# Altium schematic sheet ALARM_POWER.SchDoc
size A4
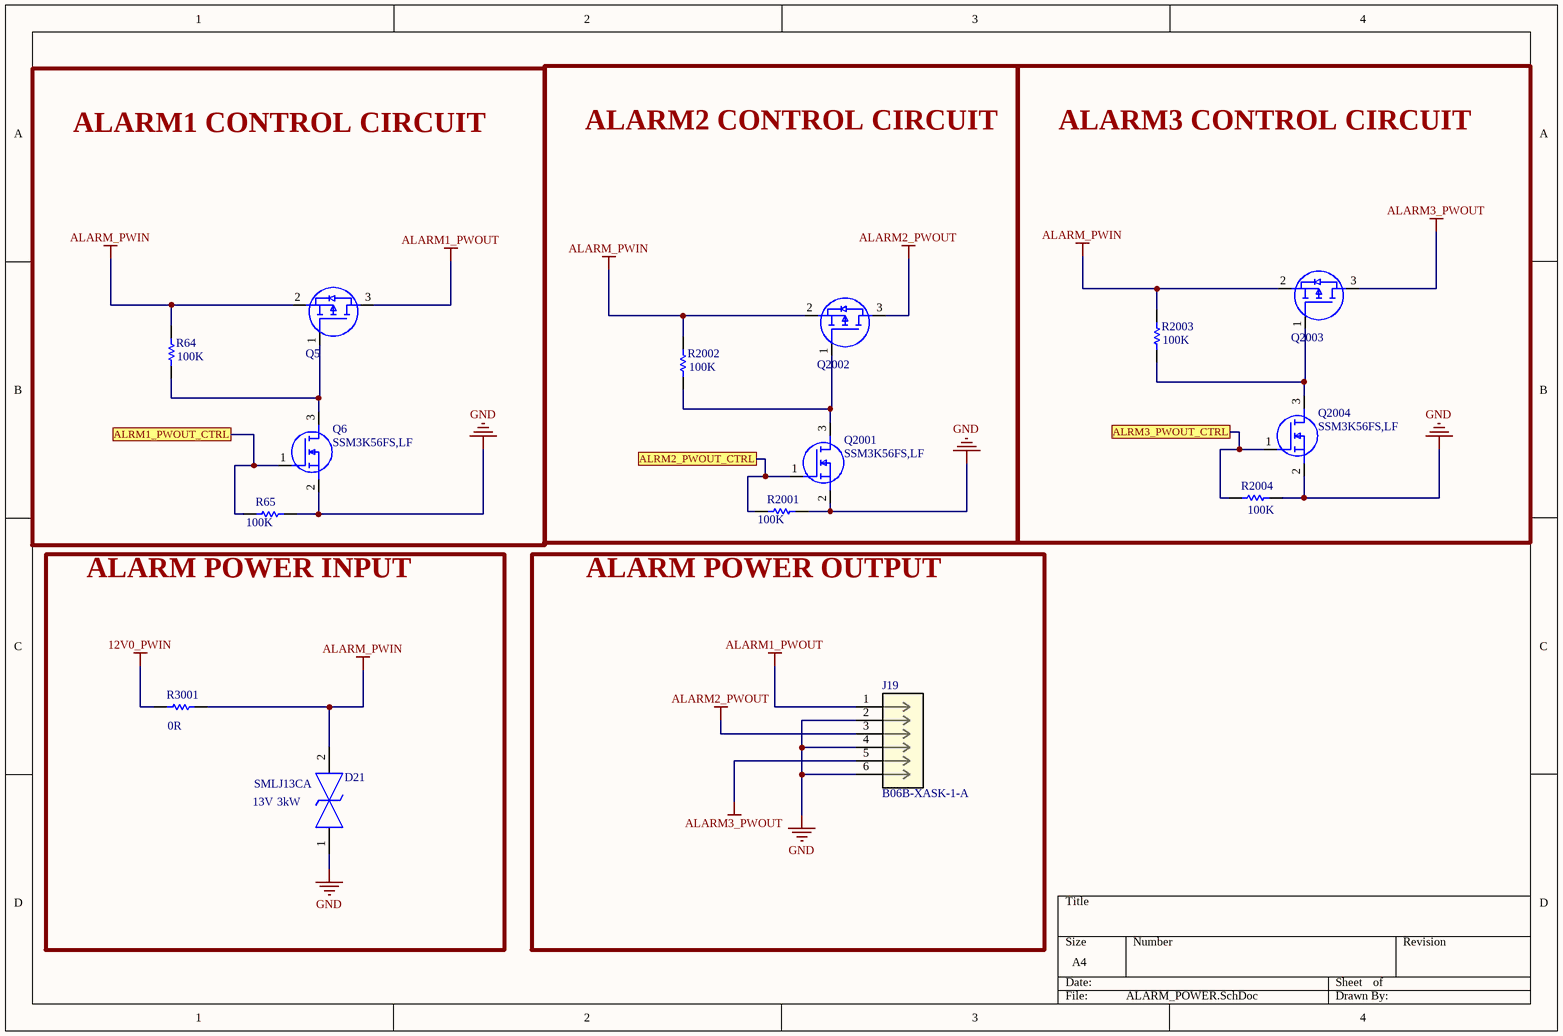
[diagram p0: ALARM_POWER.SchDoc]

## Parts
D21  SMLJ13CA  value 3kW  Voltage: 13V  [DO-214AB, SMC]
J19  B06B-XASK-1-A  [conn6_2132415-6_TEC]
Q5  SQM110P06-8M9L_GE3  [SQM110P06_MOSFET]  (value not drawn)
Q6  SSM3K56FS,LF  [SSM_TOS]
Q2001  SSM3K56FS,LF  [SSM_TOS]
Q2002  SQM110P06-8M9L_GE3  [SQM110P06_MOSFET]  (value not drawn)
Q2003  SQM110P06-8M9L_GE3  [SQM110P06_MOSFET]  (value not drawn)
Q2004  SSM3K56FS,LF  [SSM_TOS]
R64  value 100K  [RES_0402_SMD]  (hidden comment: RMCF0402JT100K)
R65  value 100K  [RES_0402_SMD]  (hidden comment: RMCF0402JT100K)
R2001  value 100K  [RES_0402_SMD]  (hidden comment: RMCF0402JT100K)
R2002  value 100K  [RES_0402_SMD]  (hidden comment: RMCF0402JT100K)
R2003  value 100K  [RES_0402_SMD]  (hidden comment: RMCF0402JT100K)
R2004  value 100K  [RES_0402_SMD]  (hidden comment: RMCF0402JT100K)
R3001  value 0R  [RES_1206_SMD]  (hidden comment: *)

## Blocks framed on the sheet
ALARM1 CONTROL CIRCUIT: Q5 Q6 R64 R65
ALARM2 CONTROL CIRCUIT: Q2001 Q2002 R2001 R2002
ALARM3 CONTROL CIRCUIT: Q2003 Q2004 R2003 R2004
ALARM POWER INPUT: D21 R3001
ALARM POWER OUTPUT: J19

## Ports
ALRM1_PWOUT_CTRL, ALRM2_PWOUT_CTRL, ALRM3_PWOUT_CTRL

## Nets
12V0_PWIN: R3001.1
ALARM1_PWOUT: J19.1 Q5.3(D)
ALARM2_PWOUT: J19.3 Q2002.3(D)
ALARM3_PWOUT: J19.5 Q2003.3(D)
ALARM_PWIN: D21.2 Q5.2(S) Q2002.2(S) Q2003.2(S) R64.2 R2002.2 R2003.2 R3001.2
GND: D21.1 J19.2 J19.4 J19.6 Q6.2(S) Q2001.2(S) Q2004.2(S) R65.1 R2001.1 R2004.1
ALRM1_PWOUT_CTRL: Q6.1(G) R65.2 ; port ALRM1_PWOUT_CTRL
ALRM2_PWOUT_CTRL: Q2001.1(G) R2001.2 ; port ALRM2_PWOUT_CTRL
ALRM3_PWOUT_CTRL: Q2004.1(G) R2004.2 ; port ALRM3_PWOUT_CTRL
NetQ5_1: Q5.1(G) Q6.3(D) R64.1
NetQ2001_3: Q2001.3(D) Q2002.1(G) R2002.1
NetQ2003_1: Q2003.1(G) Q2004.3(D) R2003.1

## Library data of the parts
D21 = SMLJ13CA: 21.5V Clamp 139.4A Ipp Tvs Diode Surface Mount SMC (DO-214AB); Tolerance: UD; Place: P; ComponentLink1Description: Digikey; ComponentLink1URL: https://www.digikey.com/en/products/detail/bourns-inc/SMLJ13CA/2253492; Package: DIONM7959X282N; Part Number: SMLJ13CA; Operating Temp.: UD
J19 = 2132415-6: No Description Available; Mfr_Name: TE Connectivity; TYPE: Header; RefDes: RefDes
Q5 Q2002 Q2003 = SQM110P06-8M9L_GE3: P-Channel 60 V 110A (Tc) 230W (Tc) Surface Mount TO-263 (D2PAK); Voltage: 20 V; Place: POP; Part Number: SQM110P06-8M9L_GE3; Value: N/A; Power: 110A; Tolerance: N/A; Package: SQM110P06-8M9L_GE3; Operating Temp.: -55°C ~ 150°C
Q6 Q2001 Q2004 = SSM3K56FS,LF: MOSFET (N-Channel); Manufacturer_Name: Toshiba; Datasheet Link: http://toshiba.semicon-storage.com/info/docget.jsp?did=13419&prodName=SSM3K56FS; Height: 0mm; Manufacturer_Part_Number: SSM3K56FS,LF; Mouser Part Number: 757-SSM3K56FSLF; Mouser Price/Stock: https://www.mouser.co.uk/ProductDetail/Toshiba/SSM3K56FSLF?qs=PiFplXvYe5XjAd54EjZm0w%3D%3D; Arrow Part Number: SSM3K56FS,LF; Arrow Price/Stock: https://www.arrow.com/en/products/ssm3k56fslf/toshiba?region=nac
R64 R65 R2001-R2004 = RES_GEN_SMD: Generic Chip Res; Place: P; Package: *; Part Number: RMCF0402JT100K; Power: *; Tolerance: *; Voltage: *; Operating Temp.: *
R3001 = RES_GEN_SMD: Generic Chip Res; Place: POP; Package: *; Part Number: *; Power: *; Tolerance: *; Voltage: *; Operating Temp.: *